# EasyEDA schematic AltoidsCanary.json
TITLE: AltoidsCanarySchematic; REV: 1.0; Date: 2019-08-20; Sheet: 1/1; Drawn By: ricardo.redin; Company: Your Company
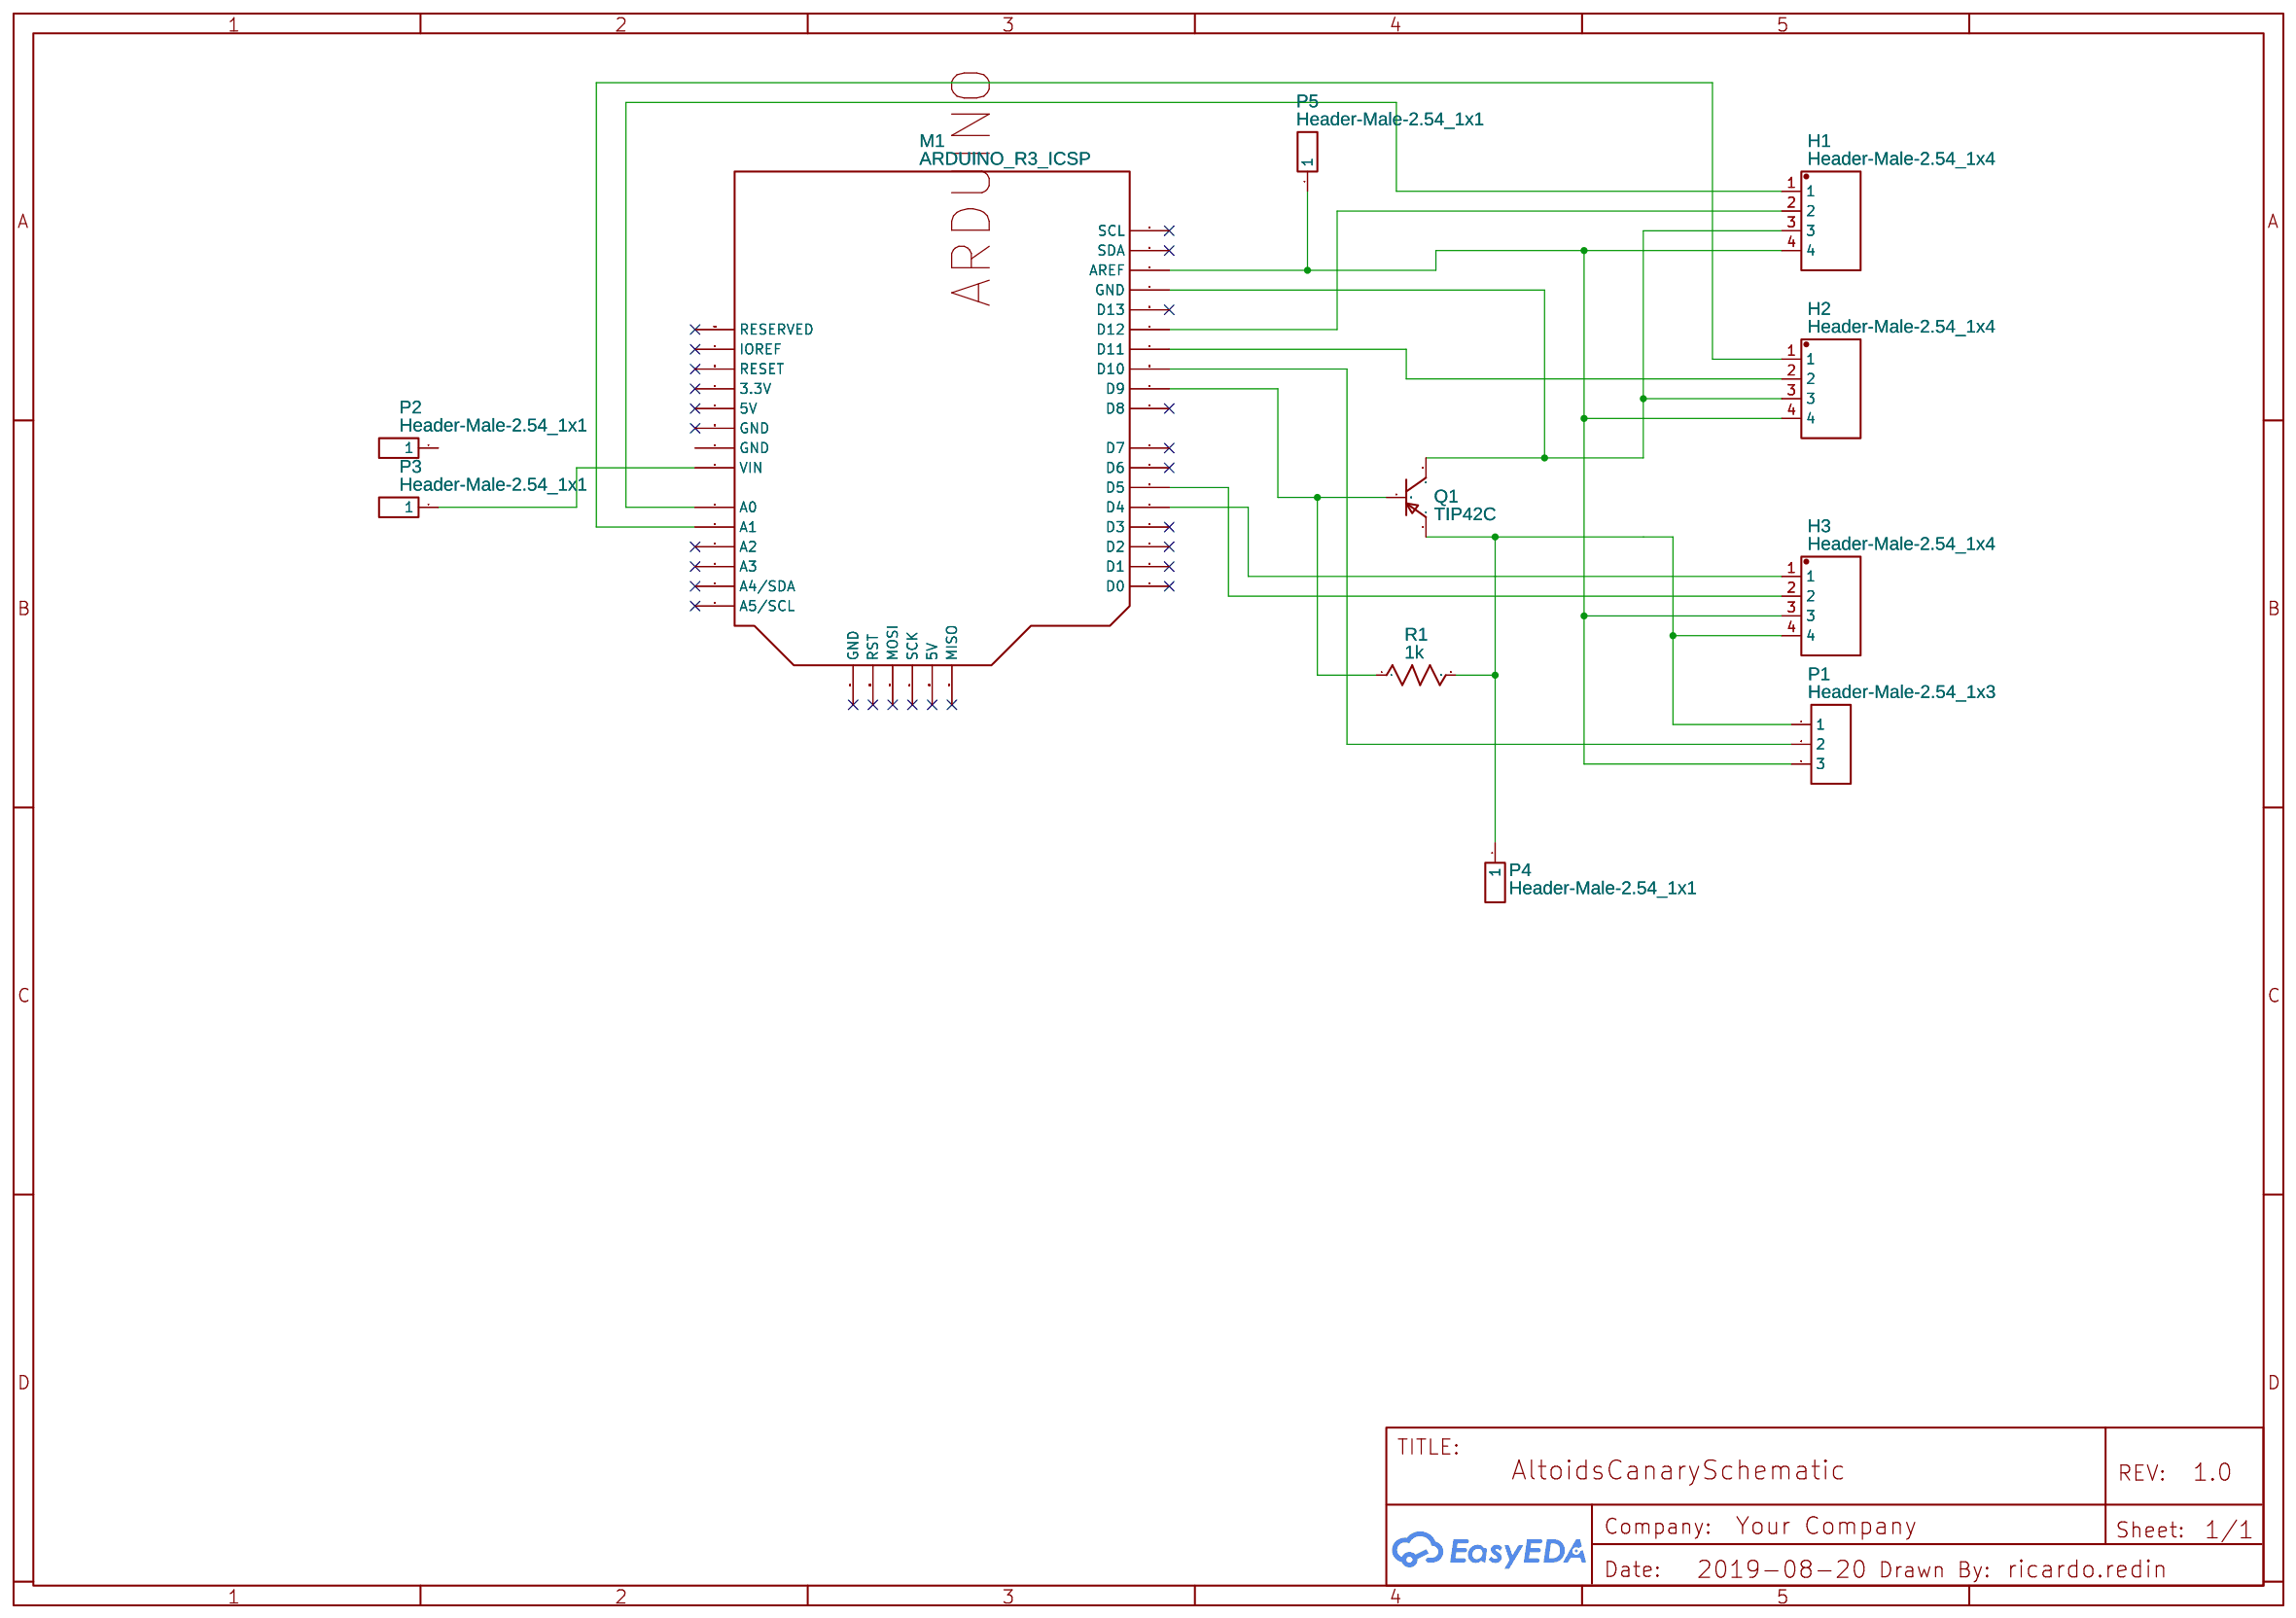
[diagram p0: schematic sheet]

## Parts
H1  Header-Male-2.54_1x4  [DIP-1X4P-2.54MM-M]
H2  Header-Male-2.54_1x4  [DIP-1X4P-2.54MM-M]
H3  Header-Male-2.54_1x4  [DIP-1X4P-2.54MM-M]
M1  ARDUINO_R3_ICSP  [ARDUINOR3_ICSP]
P1  Header-Male-2.54_1x3  [HDR-3X1/2.54]
P2  Header-Male-2.54_1x1  [HDR-1X1/2.54]
P3  Header-Male-2.54_1x1  [HDR-1X1/2.54]
P4  Header-Male-2.54_1x1  [HDR-1X1/2.54]
P5  Header-Male-2.54_1x1  [HDR-1X1/2.54]
Q1  TIP42C  [TO-220(TO-220-3)]
R1  1k  [AXIAL-0.3]

## Library data of the parts
H1-H3 = -: Supplier: LCSC; Manufacturer: Ckmtw; Manufacturer Part: 210S-1*4P L=11.6MMGold-plated black; Contributor: LCSC; Supplier Part: C124378
M1 = -: catid: 20; sourceId: qGgecxTfB; Manufacturer Part: ?
P1 = -: Supplier: LCSC; Manufacturer: BOOMELE; Manufacturer Part: Header2.54mm 1*3P; image: //image.lceda.cn/szlcsc/C49257.jpg; Supplier Part: C49257
P2-P5 = -: Supplier: LCSC; Manufacturer: ReliaPro; Supplier Part: C81276
Q1 = -: Supplier: LCSC; Manufacturer: CJ; Supplier Part: C92311
R1 = Res_AXIAL-0.3(1/8W)_US

## Nets
Net-(H1-1): H1.1 M1.A0
Net-(H1-2): H1.2 M1.D12
Net-(H1-3): H1.3 H2.3 M1.GND Q1.2(C)
Net-(H1-4): H1.4 H2.4 H3.3 M1.AREF P1.3 P5.1
Net-(H2-1): H2.1 M1.A1
Net-(H2-2): H2.2 M1.D11
Net-(H3-1): H3.1 M1.D4
Net-(H3-2): H3.2 M1.D5
Net-(H3-4): H3.4 P1.1 P4.1 Q1.3(E) R1.2
Net-(M1-D9): M1.D9 Q1.1(B) R1.1
Net-(M1-D10): M1.D10 P1.2
Net-(M1-VIN): M1.VIN P3.1

Not connected (* = marked no-connect by the designer): M1 3.3V* 5V* 5V_ICSP(5V)* A2* A3* A4(A4/SDA)* A5(A5/SCL)* D0* D1* D2* D3* D6* D7* D8* D13* IOREF* MISO* MOSI* RESERVED* RESET* RESET_ICSP(RST)* SCK* SCL* SDA*; P2 1
